# Altium project PCB_Project_3class.PrjPcb
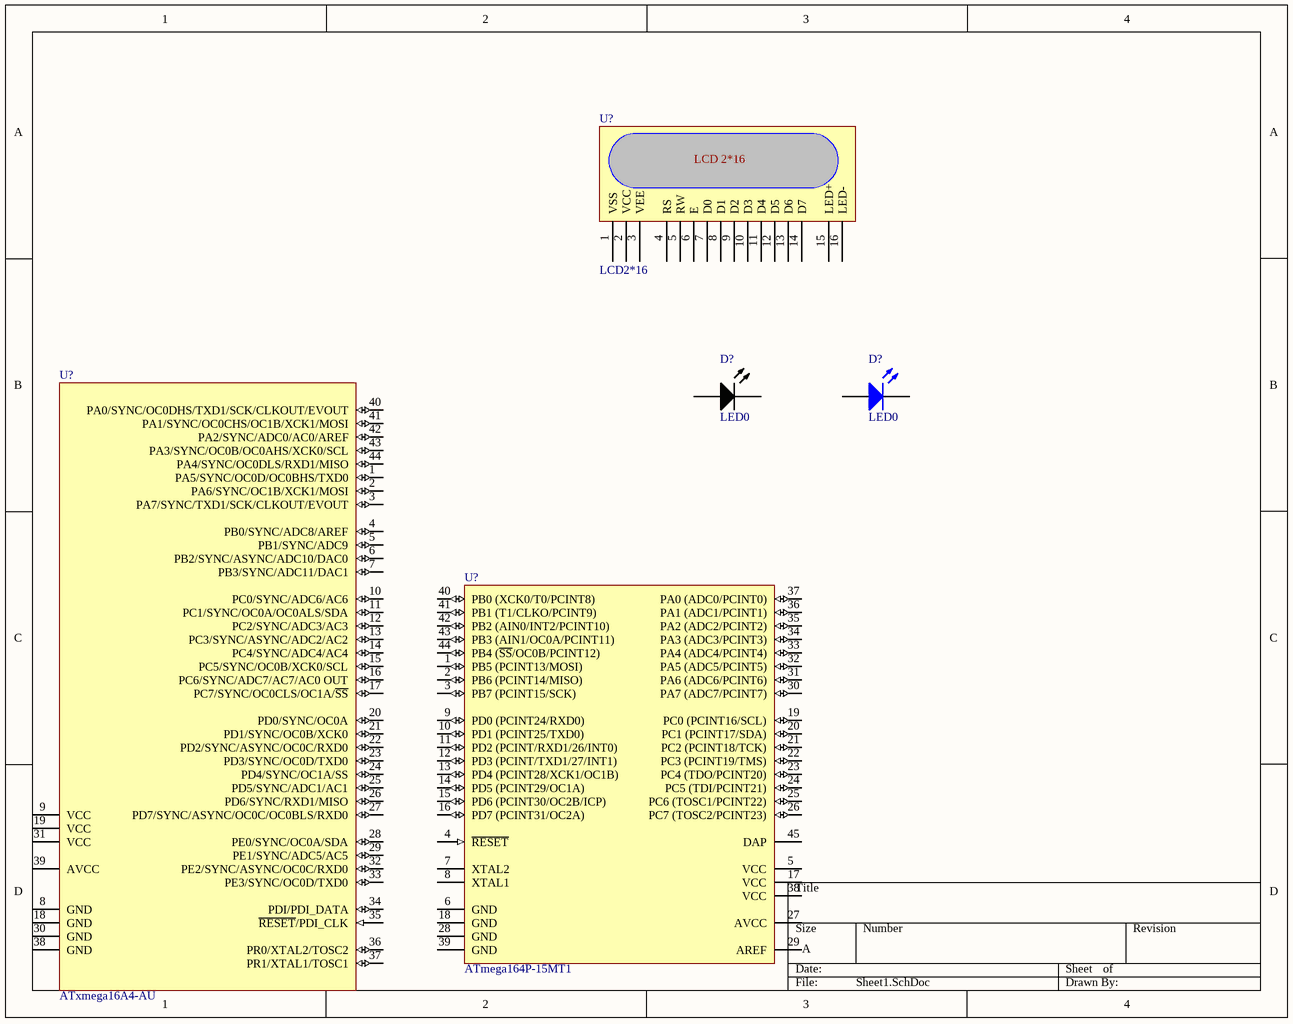
[diagram p0: Sheet1.SchDoc]
1 sheet, 5 parts. Net scope: global (net labels, ports and power ports of the same name join across sheets).

## Sheet Sheet1.SchDoc
size A

### Parts
(Parts that share a designator on the sheet are numbered #1, #2 ... from top to bottom, then left to right.)
D?#1  LED0  [LED-0]
D?#2  LED0  [LED-0]
U?#1  LCD2*16
U?#2  ATxmega16A4-AU  [44A_N]
U?#3  ATmega164P-15MT1  [44PW_N]

### Nets

Not connected (* = marked no-connect by the designer): D?#1 1(A) 2(K); D?#2 1(A) 2(K); U?#1 1(VSS) 2(VCC) 3(VEE) 4(RS) 5(RW) 6(E) 7(D0) 8(D1) 9(D2) 10(D3) 11(D4) 12(D5) 13(D6) 14(D7) 15(LED+) 16(LED-); U?#2 1(PA5/SYNC/OC0D/OC0BHS/TXD0) 2(PA6/SYNC/OC1B/XCK1/MOSI) 3(PA7/SYNC/TXD1/SCK/CLKOUT/EVOUT) 4(PB0/SYNC/ADC8/AREF) 5(PB1/SYNC/ADC9) 6(PB2/SYNC/ASYNC/ADC10/DAC0) 7(PB3/SYNC/ADC11/DAC1) 8(GND) 9(VCC) 10(PC0/SYNC/ADC6/AC6) 11(PC1/SYNC/OC0A/OC0ALS/SDA) 12(PC2/SYNC/ADC3/AC3) 13(PC3/SYNC/ASYNC/ADC2/AC2) 14(PC4/SYNC/ADC4/AC4) 15(PC5/SYNC/OC0B/XCK0/SCL) 16(PC6/SYNC/ADC7/AC7/AC0_OUT) 17(PC7/SYNC/OC0CLS/OC1A/~{SS}) 18(GND) 19(VCC) 20(PD0/SYNC/OC0A) 21(PD1/SYNC/OC0B/XCK0) 22(PD2/SYNC/ASYNC/OC0C/RXD0) 23(PD3/SYNC/OC0D/TXD0) 24(PD4/SYNC/OC1A/SS) 25(PD5/SYNC/ADC1/AC1) 26(PD6/SYNC/RXD1/MISO) 27(PD7/SYNC/ASYNC/OC0C/OC0BLS/RXD0) 28(PE0/SYNC/OC0A/SDA) 29(PE1/SYNC/ADC5/AC5) 30(GND) 31(VCC) 32(PE2/SYNC/ASYNC/OC0C/RXD0) 33(PE3/SYNC/OC0D/TXD0) 34(PDI/PDI_DATA) 35(~{RESET}/PDI_CLK) 36(PR0/XTAL2/TOSC2) 37(PR1/XTAL1/TOSC1) 38(GND) 39(AVCC) 40(PA0/SYNC/OC0DHS/TXD1/SCK/CLKOUT/EVOUT) 41(PA1/SYNC/OC0CHS/OC1B/XCK1/MOSI) 42(PA2/SYNC/ADC0/AC0/AREF) 43(PA3/SYNC/OC0B/OC0AHS/XCK0/SCL) 44(PA4/SYNC/OC0DLS/RXD1/MISO); U?#3 1(PB5_(PCINT13/MOSI)) 2(PB6_(PCINT14/MISO)) 3(PB7_(PCINT15/SCK)) 4(~{RESET}) 5(VCC) 6(GND) 7(XTAL2) 8(XTAL1) 9(PD0_(PCINT24/RXD0)) 10(PD1_(PCINT25/TXD0)) 11(PD2_(PCINT/RXD1/26/INT0)) 12(PD3_(PCINT/TXD1/27/INT1)) 13(PD4_(PCINT28/XCK1/OC1B)) 14(PD5_(PCINT29/OC1A)) 15(PD6_(PCINT30/OC2B/ICP)) 16(PD7_(PCINT31/OC2A)) 17(VCC) 18(GND) 19(PC0_(PCINT16/SCL)) 20(PC1_(PCINT17/SDA)) 21(PC2_(PCINT18/TCK)) 22(PC3_(PCINT19/TMS)) 23(PC4_(TDO/PCINT20)) 24(PC5_(TDI/PCINT21)) 25(PC6_(TOSC1/PCINT22)) 26(PC7_(TOSC2/PCINT23)) 27(AVCC) 28(GND) 29(AREF) 30(PA7_(ADC7/PCINT7)) 31(PA6_(ADC6/PCINT6)) 32(PA5_(ADC5/PCINT5)) 33(PA4_(ADC4/PCINT4)) 34(PA3_(ADC3/PCINT3)) 35(PA2_(ADC2/PCINT2)) 36(PA1_(ADC1/PCINT1)) 37(PA0_(ADC0/PCINT0)) 38(VCC) 39(GND) 40(PB0_(XCK0/T0/PCINT8)) 41(PB1_(T1/CLKO/PCINT9)) 42(PB2_(AIN0/INT2/PCINT10)) 43(PB3_(AIN1/OC0A/PCINT11)) 44(PB4_(~{SS}/OC0B/PCINT12)) 45(DAP)

### Notes on the sheet
- (in symbol LCD2*16) LCD 2*16

### Library data of the parts
D?#1 D?#2 = LED0: Typical INFRARED GaAs LED; Published: 8-Jun-2000; LatestRevisionDate: 08-Jul-2005; LatestRevisionNote: Mech Layer 1 removed.; PackageReference: LED-0; Publisher: Altium Limited; PackageDescription: LED; 2 Leads
U?#2 = ATxmega16A4-AU: 8/16-bit AVR XMEGA A4 Microcontroller, 1.6-3.6V, 16KB + 4KB Flash, 1KB EEPROM, 2KB SRAM, 44-pin TQFP, Industrial Grade (-40°C to 85°C), Pb-Free; Published: 1-Apr-2010; DatasheetVersion: revN, Feb-2010; PackageVersion: rev.B, Oct-2001; PackageReference: 44A; Publisher: Altium Limited; PackageDescription: 44-Pin Plastic Thin Profile Quad Flat Pack, 10 x 10 x 1.0 mm Body, 0.8 mm Pitch (TQFP); Supplier 1: Digi-Key; Supplier Part Number 1: ATXMEGA16A4-AU-ND; Supplier 2: Farnell; Supplier Part Number 2: 1748552; Supplier 3: Mouser; Supplier Part Number 3: 556-ATXMEGA16A4-AU; ComponentLink1Description: Manufacturer Link; ComponentLink1URL: http://www.atmel.com/products/avr/default.asp?; ComponentLink2Description: ATxmega16A4/32A4/64A4/128A4 Datasheet; ComponentLink2URL: http://www.atmel.com/dyn/resources/prod_documents/doc8069.pdf; ComponentLink3Description: Atmel.com Home; ComponentLink3URL: http://www.atmel.com
U?#3 = ATmega164P-15MT1: 8-bit Automotive AVR Microcontroller, 16KB Flash, 512 Bytes EEPROM, 1KB SRAM, Reduced Automotive Grade (-40°C to +105°C), 44-Pin VQFN; Published: 1-Apr-2010; DatasheetVersion: revF, Sep-2009; PackageVersion: revF, Jul-2007; PackageReference: 44PW; Publisher: Altium Limited; PackageDescription: 44-Pin Quad Flat No-Lead Package, 7 x 7 mm Body, 0.5 mm Pitch (QFN); Supplier 1: Digi-Key; Supplier Part Number 1: ATMEGA164P-15MT1-ND; Supplier 2: Mouser; Supplier Part Number 2: 556-ATMEGA164P-15MT1; Code_JEDEC: MO-220-VKKD-1; ComponentLink1Description: Manufacturer Link; ComponentLink1URL: http://www.atmel.com/products/avr/default.asp?; ComponentLink2Description: ATmega164P/324P/644P Datasheet; ComponentLink2URL: http://www.atmel.com/dyn/resources/prod_documents/doc7674.pdf; ComponentLink3Description: ATmega164P/324P/644P Summary; ComponentLink3URL: http://www.atmel.com/dyn/resources/prod_documents/doc7674S.pdf; ComponentLink4Description: Atmel.com Home; ComponentLink4URL: http://www.atmel.com